# Altium project UNOTH_Rev3.PrjPcb
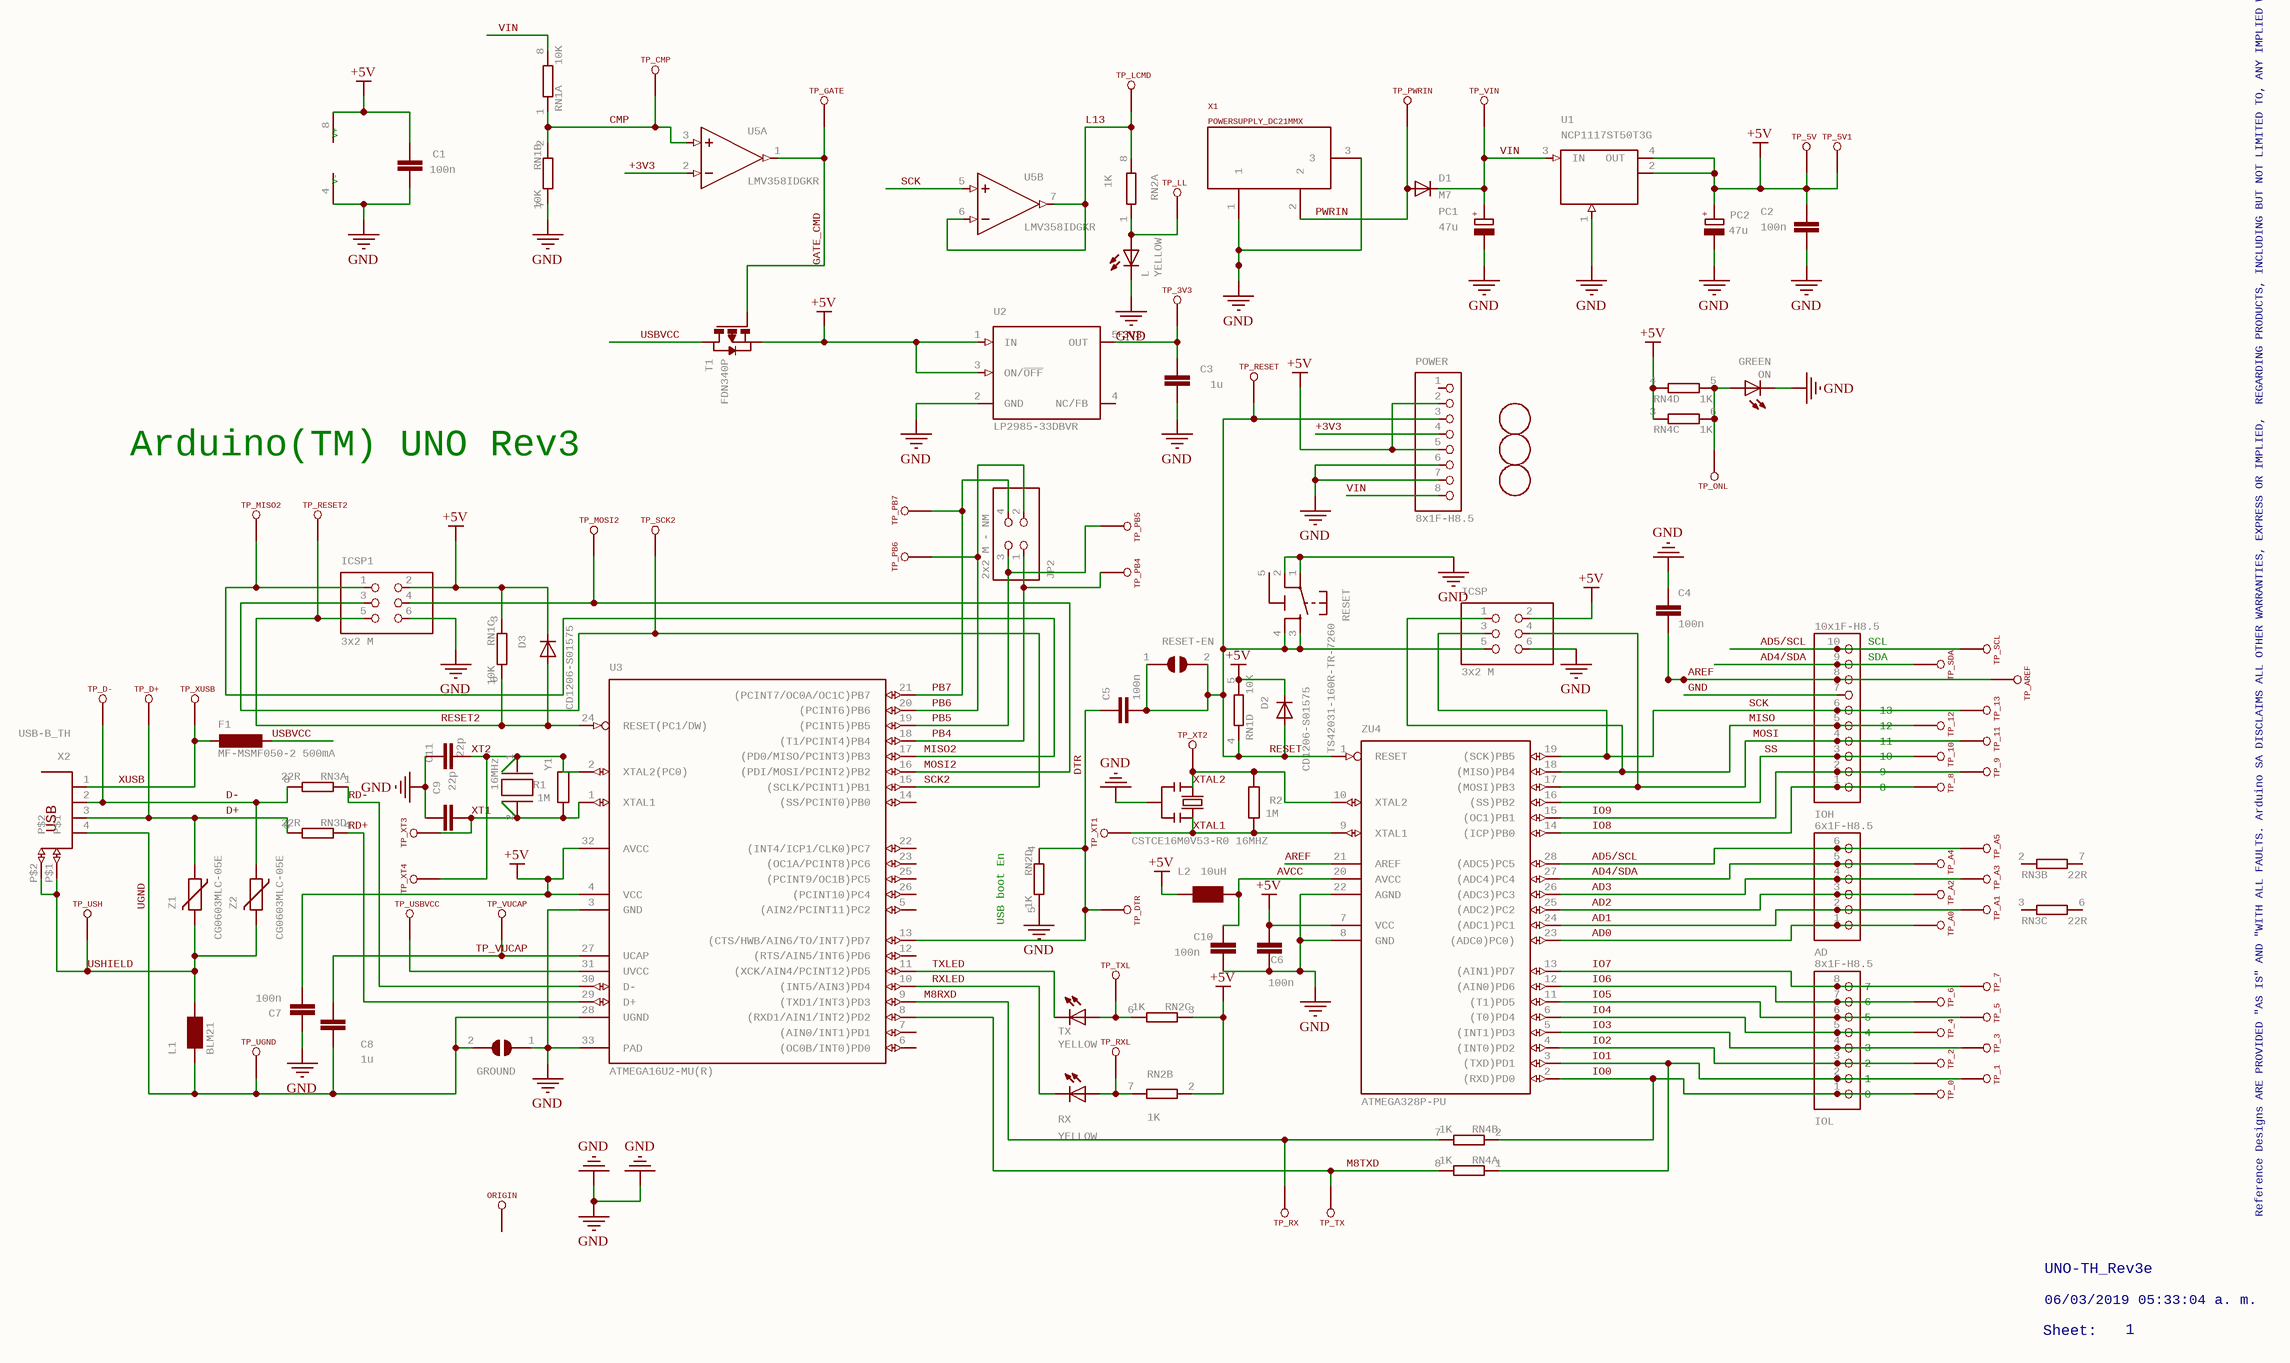
[diagram p0: UNO-TH_Rev3e.SchDoc]
1 sheet, 113 parts. Net scope: global (net labels, ports and power ports of the same name join across sheets).
Board file: UNO-TH_Rev3e.PcbDoc

## Sheet UNO-TH_Rev3e.SchDoc
size 409 x 289 mm; Organization: ORGANIZATION; Address1: ADDRESS 1; Address2: ADDRESS 2; Address3: ADDRESS 3; Address4: ADDRESS 4; Revision: *.*.*; SheetTotal: 1; ENG_APP_DATE: --/--/--; DSN_APP_DATE: --/--/--; CHK_APP_DATE: --/--/--; Origin: Eagle; OriginPath: C:\Users\alima\Downloads\6to_Semestre\DiseñoPCBS\ProyectoFinal\Proyecto-PCB\OficialArduino\UNO-TH_Rev3e-Eagle\UNO-TH_Rev3e.sch; OriginSheet: 1; DRAWING_NAME: UNO-TH_Rev3e; LAST_DATE_TIME: 06/03/2019 05:33:04 a. m.; SHEET: 1; CODE-ARDUINO: DNP; DATASHEET: DNP; DISTRIBUTOR-LINK: DNP; DISTRIBUTOR-PN: DNP; MANUFACTURER: DNP; MANUFACTURER-PN: DNP; NOTE: DNP; Value: DNP; SheetNumber: 1

### Parts
AD  6x1F-H8.5  [1X06]
C1  100n  [C0603-ROUND]
C2  100n  [C0603-ROUND]
C3  1u  [C0603-ROUND]
C4  100n  [C0603-ROUND]
C5  100n  [C0603-ROUND]
C6  100n  [C0603-ROUND]
C7  100n  [C0603-ROUND]
C8  1u  [C0603-ROUND]
C9  22p  [C0603-ROUND]
C10  100n  [C0603-ROUND]
C11  22p  [C0603-ROUND]
D1  M7  [SMB]
D2  CD1206-S01575  [MINIMELF]
D3  CD1206-S01575  [MINIMELF]
F1  MF-MSMF050-2 500mA  [L1812]
FD1  FIDUCIALMOUNT  [FIDUCIA-MOUNT]  (value not drawn)
FD2  FIDUCIALMOUNT  [FIDUCIA-MOUNT]  (value not drawn)
FD3  FIDUCIALMOUNT  [FIDUCIA-MOUNT]  (value not drawn)
GROUND  SJ  [SJ]  (value not drawn)
ICSP  3x2 M  [2X03]
ICSP1  3x2 M  [2X03]
IOH  10x1F-H8.5  [1X10]
IOL  8x1F-H8.5  [1X08]
JP2  2x2 M - NM  [2X02]
L  YELLOW  [CHIP-LED0805]
L1  BLM21  [0805]
L2  10uH  [0805]
ON  GREEN  [CHIP-LED0805]
ORIGIN  TP_SP  [TP-SP]  (value not drawn)
PC1  47u  [PANASONIC_D]
PC2  47u  [PANASONIC_D]
POWER  8x1F-H8.5  [1X08]
R1  1M  [R0603-ROUND]
R2  1M  [R0603-ROUND]
RESET  TS42031-160R-TR-7260  [TS42]
RESET-EN  SJ  [SJ]  (value not drawn)
RN1  10K  [CAY16]  (parts A,B,C,D of 4)
RN2  1K  [CAY16]  (parts A,B,C,D of 4)
RN3  22R  [CAY16]  (parts A,B,C,D of 4)
RN4  1K  [CAY16]  (parts A,B,C,D of 4)
RX  YELLOW  [CHIP-LED0805]
T1  FDN340P  [SOT-23]
TP_0  TP_SP  [TP-SP]  (value not drawn)
TP_1  TP_SP  [TP-SP]  (value not drawn)
TP_2  TP_SP  [TP-SP]  (value not drawn)
TP_3  TP_SP  [TP-SP]  (value not drawn)
TP_3V3  TP_SP  [TP-SP]  (value not drawn)
TP_4  TP_SP  [TP-SP]  (value not drawn)
TP_5  TP_SP  [TP-SP]  (value not drawn)
TP_5V  TP_SP  [TP-SP]  (value not drawn)
TP_5V1  TP_SP  [TP-SP]  (value not drawn)
TP_6  TP_SP  [TP-SP]  (value not drawn)
TP_7  TP_SP  [TP-SP]  (value not drawn)
TP_8  TP_SP  [TP-SP]  (value not drawn)
TP_9  TP_SP  [TP-SP]  (value not drawn)
TP_10  TP_SP  [TP-SP]  (value not drawn)
TP_11  TP_SP  [TP-SP]  (value not drawn)
TP_12  TP_SP  [TP-SP]  (value not drawn)
TP_13  TP_SP  [TP-SP]  (value not drawn)
TP_A0  TP_SP  [TP-SP]  (value not drawn)
TP_A1  TP_SP  [TP-SP]  (value not drawn)
TP_A2  TP_SP  [TP-SP]  (value not drawn)
TP_A3  TP_SP  [TP-SP]  (value not drawn)
TP_A4  TP_SP  [TP-SP]  (value not drawn)
TP_A5  TP_SP  [TP-SP]  (value not drawn)
TP_AREF  TP_SP  [TP-SP]  (value not drawn)
TP_CMP  TP_SP  [TP-SP]  (value not drawn)
TP_D+  TP_SP  [TP-SP]  (value not drawn)
TP_D-  TP_SP  [TP-SP]  (value not drawn)
TP_DTR  TP_SP  [TP-SP]  (value not drawn)
TP_GATE  TP_SP  [TP-SP]  (value not drawn)
TP_LCMD  TP_SP  [TP-SP]  (value not drawn)
TP_LL  TP_SP  [TP-SP]  (value not drawn)
TP_MISO2  TP_SP  [TP-SP]  (value not drawn)
TP_MOSI2  TP_SP  [TP-SP]  (value not drawn)
TP_ONL  TP_SP  [TP-SP]  (value not drawn)
TP_PB4  TP_SP  [TP-SP]  (value not drawn)
TP_PB5  TP_SP  [TP-SP]  (value not drawn)
TP_PB6  TP_SP  [TP-SP]  (value not drawn)
TP_PB7  TP_SP  [TP-SP]  (value not drawn)
TP_PWRIN  TP_SP  [TP-SP]  (value not drawn)
TP_RESET  TP_SP  [TP-SP]  (value not drawn)
TP_RESET2  TP_SP  [TP-SP]  (value not drawn)
TP_RX  TP_SP  [TP-SP]  (value not drawn)
TP_RXL  TP_SP  [TP-SP]  (value not drawn)
TP_SCK2  TP_SP  [TP-SP]  (value not drawn)
TP_SCL  TP_SP  [TP-SP]  (value not drawn)
TP_SDA  TP_SP  [TP-SP]  (value not drawn)
TP_TX  TP_SP  [TP-SP]  (value not drawn)
TP_TXL  TP_SP  [TP-SP]  (value not drawn)
TP_UGND  TP_SP  [TP-SP]  (value not drawn)
TP_USBVCC  TP_SP  [TP-SP]  (value not drawn)
TP_USH  TP_SP  [TP-SP]  (value not drawn)
TP_VIN  TP_SP  [TP-SP]  (value not drawn)
TP_VUCAP  TP_SP  [TP-SP]  (value not drawn)
TP_XT1  TP_SP  [TP-SP]  (value not drawn)
TP_XT2  TP_SP  [TP-SP]  (value not drawn)
TP_XT3  TP_SP  [TP-SP]  (value not drawn)
TP_XT4  TP_SP  [TP-SP]  (value not drawn)
TP_XUSB  TP_SP  [TP-SP]  (value not drawn)
TX  YELLOW  [CHIP-LED0805]
U1  NCP1117ST50T3G  [SOT223]
U2  LP2985-33DBVR  [SOT23-DBV]
U3  ATMEGA16U2-MU(R)  [MLF32]
U5  LMV358IDGKR  [MSOP08]  (parts A,B,C of 3)
X1  POWERSUPPLY_DC21MMX  [POWERSUPPLY_DC-21MM]
X2  USB-B_TH  [PN61729]
Y1  16MHz  [QS]
Y2  CSTCE16M0V53-R0 16MHZ  [RESONATOR]
Z1  CG0603MLC-05E  [CT/CN0603]
Z2  CG0603MLC-05E  [CT/CN0603]
ZU4  ATMEGA328P-PU  [DIL28-3]

### Nets
+5V: C1.2 C2.2 C6.2 C7.1 D2.C D3.C ICSP.2 ICSP1.2 L2.1 PC2.+ POWER.2 POWER.5 RN1.3 RN1.5 RN2.2 RN2.3 RN4.3 RN4.4 T1.2(S) TP_5V.X(TESTP) TP_5V1.X(TESTP) U1.2(OUT) U1.4(OUT) U2.1(IN) U2.3(ON/~{OFF}) U3.4(VCC) U3.32(AVCC) U5.8(V+) ZU4.7(VCC)
GND: C1.1 C2.1 C3.1 C4.1 C6.1 C7.2 C9.2 C10.1 C11.2 GROUND.1 ICSP.6 ICSP1.6 IOH.7 L.C ON.C PC1.- PC2.- POWER.6 POWER.7 RESET.1 RESET.2 RN1.7 RN2.5 U1.1(GND/ADJ) U2.2(GND) U3.3(GND) U3.33(PAD) U5.4(V-) X1.1 X1.3 Y2.2 ZU4.8(GND) ZU4.22(AGND)
+3V3: C3.2 POWER.4 TP_3V3.X(TESTP) U2.5(OUT) U5.2(-IN)
AD0: AD.1 TP_A0.X(TESTP) ZU4.23((ADC0)PC0))
AD1: AD.2 TP_A1.X(TESTP) ZU4.24((ADC1)PC1)
AD2: AD.3 TP_A2.X(TESTP) ZU4.25((ADC2)PC2)
AD3: AD.4 TP_A3.X(TESTP) ZU4.26((ADC3)PC3)
AD4/SDA: AD.5 IOH.9 TP_A4.X(TESTP) TP_SDA.X(TESTP) ZU4.27((ADC4)PC4)
AD5/SCL: AD.6 IOH.10 TP_A5.X(TESTP) TP_SCL.X(TESTP) ZU4.28((ADC5)PC5)
AREF: C4.2 IOH.8 TP_AREF.X(TESTP) ZU4.21(AREF)
AVCC: C10.2 L2.2 ZU4.20(AVCC)
CMP: RN1.1 RN1.2 TP_CMP.X(TESTP) U5.3(+IN)
D+: RN3.5 TP_D+.X(TESTP) X2.3 Z1.1
D-: RN3.8 TP_D-.X(TESTP) X2.2 Z2.1
DTR: C5.1 RN2.4 TP_DTR.X(TESTP) U3.13((CTS/HWB/AIN6/TO/INT7)PD7)
GATE_CMD: T1.3(G) TP_GATE.X(TESTP) U5.1(OUT)
IO0: IOL.1 RN4.2 TP_0.X(TESTP) ZU4.2((RXD)PD0)
IO1: IOL.2 RN4.1 TP_1.X(TESTP) ZU4.3((TXD)PD1)
IO2: IOL.3 TP_2.X(TESTP) ZU4.4((INT0)PD2)
IO3: IOL.4 TP_3.X(TESTP) ZU4.5((INT1)PD3)
IO4: IOL.5 TP_4.X(TESTP) ZU4.6((T0)PD4)
IO5: IOL.6 TP_5.X(TESTP) ZU4.11((T1)PD5)
IO6: IOL.7 TP_6.X(TESTP) ZU4.12((AIN0)PD6)
IO7: IOL.8 TP_7.X(TESTP) ZU4.13((AIN1)PD7)
IO8: IOH.1 TP_8.X(TESTP) ZU4.14((ICP)PB0)
IO9: IOH.2 TP_9.X(TESTP) ZU4.15((OC1)PB1)
L13: RN2.8 TP_LCMD.X(TESTP) U5.6(-IN) U5.7(OUT)
M8RXD: RN4.7 TP_RX.X(TESTP) U3.9((TXD1/INT3)PD3)
M8TXD: RN4.8 TP_TX.X(TESTP) U3.8((RXD1/AIN1/INT2)PD2)
MISO: ICSP.1 IOH.5 TP_12.X(TESTP) ZU4.18((MISO)PB4)
MISO2: ICSP1.1 TP_MISO2.X(TESTP) U3.17((PD0/MISO/PCINT3)PB3)
MOSI: ICSP.4 IOH.4 TP_11.X(TESTP) ZU4.17((MOSI)PB3)
MOSI2: ICSP1.4 TP_MOSI2.X(TESTP) U3.16((PDI/MOSI/PCINT2)PB2)
PB4: JP2.1 TP_PB4.X(TESTP) U3.18((T1/PCINT4)PB4)
PB5: JP2.3 TP_PB5.X(TESTP) U3.19((PCINT5)PB5)
PB6: JP2.2 TP_PB6.X(TESTP) U3.20((PCINT6)PB6)
PB7: JP2.4 TP_PB7.X(TESTP) U3.21((PCINT7/OC0A/OC1C)PB7)
PWRIN: D1.A TP_PWRIN.X(TESTP) X1.2
RD+: RN3.4 U3.29(D+)
RD-: RN3.1 U3.30(D-)
RESET: C5.2 D2.A ICSP.5 POWER.3 RESET.3 RESET.4 RESET-EN.1 RESET-EN.2 RN1.4 TP_RESET.X(TESTP) ZU4.1(RESET)
RESET2: D3.A ICSP1.5 RN1.6 TP_RESET2.X(TESTP) U3.24(RESET(PC1/DW))
RXLED: RX.C U3.10((INT5/AIN3)PD4)
SCK: ICSP.3 IOH.6 TP_13.X(TESTP) U5.5(+IN) ZU4.19((SCK)PB5)
SCK2: ICSP1.3 TP_SCK2.X(TESTP) U3.15((SCLK/PCINT1)PB1)
SS: IOH.3 TP_10.X(TESTP) ZU4.16((SS)PB2)
TP_VUCAP: C8.1 TP_VUCAP.X(TESTP) U3.27(UCAP)
TXLED: TX.C U3.11((XCK/AIN4/PCINT12)PD5)
UGND: C8.2 GROUND.2 L1.1 TP_UGND.X(TESTP) U3.28(UGND) X2.4
USBVCC: F1.1 T1.1(D)
USHIELD: L1.2 TP_USH.X(TESTP) X2.P$1 X2.P$2 Z1.2 Z2.2
VIN: D1.C PC1.+ POWER.8 RN1.8 TP_VIN.X(TESTP) U1.3(IN)
XT1: C9.1 R1.1 TP_XT3.X(TESTP) U3.1(XTAL1) Y1.2
XT2: C11.1 R1.2 TP_XT4.X(TESTP) U3.2(XTAL2(PC0)) Y1.1
XTAL1: R2.1 TP_XT1.X(TESTP) Y2.3 ZU4.9(XTAL1)
XTAL2: R2.2 TP_XT2.X(TESTP) Y2.1 ZU4.10(XTAL2)
XUSB: F1.2 TP_XUSB.X(TESTP) X2.1
NetL_A: L.A RN2.1 TP_LL.X(TESTP)
NetON_A: ON.A RN4.5 RN4.6 TP_ONL.X(TESTP)
NetRN2_6: RN2.6 TP_TXL.X(TESTP) TX.A
NetRN2_7: RN2.7 RX.A TP_RXL.X(TESTP)
NetTP_USBVCC_X: TP_USBVCC.X(TESTP) U3.31(UVCC)

Not connected (* = marked no-connect by the designer): ORIGIN X(TESTP); POWER 1; RESET 5(5-GND); RN3 2(1) 3(1) 6(2) 7(2); U2 4(NC/FB); U3 5((AIN2/PCINT11)PC2) 6((OC0B/INT0)PD0) 7((AIN0/INT1)PD1) 12((RTS/AIN5/INT6)PD6) 14((SS/PCINT0)PB0) 22((INT4/ICP1/CLK0)PC7) 23((OC1A/PCINT8)PC6) 25((PCINT9/OC1B)PC5) 26((PCINT10)PC4)

### Notes on the sheet
- Arduino(TM) UNO Rev3
- (near IOH) SDA
- (near IOH) SCL
- (near IOH) 11
- (near IOH) 12
- (near IOH) 13
- (near IOH) 8
- (near IOH) 9
- (near IOH) 10
- (near RN2) USB boot En
- (near IOL) 3
- (near IOL) 4
- (near IOL) 5
- (near IOL) 6
- (near IOL) 7
- (near IOL) 0
- (near IOL) 1
- (near IOL) 2
- Reference Designs ARE PROVIDED "AS IS" AND "WITH ALL FAULTS. Arduino SA DISCLAIMS ALL OTHER WARRANTIES, EXPRESS OR IMPLIED,
  REGARDING PRODUCTS, INCLUDING BUT NOT LIMITED TO, ANY IMPLIED WARRANTIES OF MERCHANTABILITY OR FITNESS FOR A PARTICULAR PURPOSE
  Arduino SA may make changes to specifications and product descriptions at any time, without notice. The Customer must not
  rely on the absence or characteristics of any features or instructions marked "reserved" or "undefined." Arduino SA reserves
  these for future definition and shall have no responsibility whatsoever for conflicts or incompatibilities arising from future changes to them.
  The product information on the Web Site or Materials is subject to change without notice. Do not finalize a design with this info
  ARDUINO and other Arduino brands and logos and Trademarks of Arduino SA. All Arduino SA Trademarks cannot be used without owner's formal permission
- UNO-TH_Rev3e
- Sheet:
- 06/03/2019 05:33:04 a. m.
- 1
- TITLE
- DESIGNER
- PRODUCT NUMBER
- SHEET VERSION
- LAST MODIFIED
- SHEET
- OF

### Library data of the parts
AD = PINHD-1X6: PIN HEADER; GateName_1: A; SymbolName_1: PINHD6; LibraryName: SmartPrj; DeviceSetName: PINHD-1X6
C1-C11 = C-EU0603-RND: CAPACITOR, European symbol; GateName_1: G$1; SymbolName_1: C-EU; DeviceName: 0603-RND; LibraryName: SmartPrj; DeviceSetName: C-EU
D1 = DIODE-SMB: DIODE; GateName_1: G$1; SymbolName_1: D; DeviceSetName: DIODE-; DeviceName: SMB; LibraryName: diode
D2 D3 = DIODE-MINIMELF: DIODE; GateName_1: G$1; SymbolName_1: D; DeviceSetName: DIODE-; DeviceName: MINIMELF; LibraryName: diode
F1 = L-EUL1812: INDUCTOR, European symbol; GateName_1: G$1; SymbolName_1: L-EU; DeviceName: L1812; LibraryName: rcl; DeviceSetName: L-EU
FD1-FD3 = FIDUCIALMOUNT: GateName_1: G$1; SymbolName_1: FIDUCIAL; LibraryName: SmartPrj; DeviceSetName: FIDUCIALMOUNT
GROUND RESET-EN = SJ: SMD solder JUMPER; GateName_1: 1; SymbolName_1: SJ; LibraryName: jumper; DeviceSetName: SJ
ICSP ICSP1 = PINHD-2X3: PIN HEADER; GateName_1: A; SymbolName_1: PINH2X3; LibraryName: SmartPrj; DeviceSetName: PINHD-2X3
IOH = PINHD-1X10_ARD: PIN HEADER; GateName_1: A; SymbolName_1: PINHD10; LibraryName: SmartPrj; DeviceSetName: PINHD-1X10_ARD
IOL POWER = PINHD-1X8: PIN HEADER; GateName_1: A; SymbolName_1: PINHD8; LibraryName: SmartPrj; DeviceSetName: PINHD-1X8
JP2 = PINHD-2X2: PIN HEADER; GateName_1: A; SymbolName_1: PINH2X2; LibraryName: SmartPrj; DeviceSetName: PINHD-2X2
L ON RX TX = LEDCHIP-LED0805: LED   OSRAM: - CHIPLED LG R971, LG N971, LY N971, LG Q971, LY Q971, LO R971, LY R971 LH N974, LH R974 LS Q976, LO Q976, LY Q976 LO Q996 - Hyper CHIPLED LW Q18S LB Q993, LB Q99A, LB R99A - SideLED LS A670, LO A670, LY A670, LG A670, LP A670 LB A673, LV A673, LT A673, LW A673 LH A674 LY A675 LS A676, LA A676, LO A676, LY A676, LW A676 LS A679, LY A679, LG A679 -  Hyper Micro SIDELEDÂ® LS Y876, LA Y876, LO Y876, LY Y876 LT Y87S - SmartLED LW L88C, LW L88S LB L89C, LB L89S, LG L890 LS L89K, LO L89K, LY L89K LS L896, LA L896, LO L896, LY L896 - TOPLED LS T670, LO T670, LY T670, LG T670, LP T670 LSG T670, LSP T670, LSY T670, LOP T670, LYG T670 LG T671, LOG T671, LSG T671 LB T673, LV T673, LT T673, LW T673 LH T674 LS T676, LA T676, LO T676, LY T676, LB T676, LH T676, LSB T676, LW T676 LB T67C, LV T67C, LT T67C, LS T67K, LO T67K, LY T67K, LW E67C LS E67B, LA E67B, LO E67B, LY E67B, LB E67C, LV E67C, LT E67C LW T67C LS T679, LY T679, LG T679 LS T770, LO T770, LY T770, LG T770, LP T770 LB T773, LV T773, LT T773, LW T773 LH T774 LS E675, LA E675, LY E675, LS T675 LS T776, LA T776, LO T776, LY T776, LB T776 LHGB T686 LT T68C, LB T68C - Hyper Mini TOPLEDÂ® LB M676 - Mini TOPLED SantanaÂ® LG M470 LS M47K, LO M47K, LY M47K    Source: http://www.osram.convergy.de   LUXEON: - LUMILEDÂ® LXK2-PW12-R00, LXK2-PW12-S00, LXK2-PW14-U00, LXK2-PW14-V00 LXK2-PM12-R00, LXK2-PM12-S00, LXK2-PM14-U00 LXK2-PE12-Q00, LXK2-PE12-R00, LXK2-PE12-S00, LXK2-PE14-T00, LXK2-PE14-U00 LXK2-PB12-K00, LXK2-PB12-L00, LXK2-PB12-M00, LXK2-PB14-N00, LXK2-PB14-P00, LXK2-PB14-Q00 LXK2-PR12-L00, LXK2-PR12-M00, LXK2-PR14-Q00, LXK2-PR14-R00 LXK2-PD12-Q00, LXK2-PD12-R00, LXK2-PD12-S00 LXK2-PH12-R00, LXK2-PH12-S00 LXK2-PL12-P00, LXK2-PL12-Q00, LXK2-PL12-R00    Source: www.luxeon.com   KINGBRIGHT:   KA-3528ASYC Source: www.kingbright.com; GateName_1: G$1; SymbolName_1: LED; DeviceName: CHIP-LED0805; LibraryName: led; DeviceSetName: LED
L1 = WE-CBF_0805: SMD EMI Suppression Ferrite Beads - excellent anti-EMI properties - low DCR - impedances till 3000 ohms - rated current up to 6 A; GateName_1: G$1; SymbolName_1: L; DeviceName: _0805; DeviceSetName: WE-CBF; LibraryName: wuerth-elektronik
L2 = 0715_CV201210-100K: 10uH 0805; GateName_1: G$1; SymbolName_1: L; MONTHLY_USAGE: _____; TYPE: Induttanze; LibraryName: Induttanze; DeviceSetName: 0715_CV201210-100K; CASE: 0805; PART_NUMBER: CV201210-100K; PRICE: _____; SUPPLIER: _____
ORIGIN TP_0-TP_3 TP_3V3 TP_4 TP_5 TP_5V TP_5V1 TP_6-TP_13 TP_A0-TP_A5 TP_AREF TP_CMP TP_D+ TP_D- TP_DTR TP_GATE TP_LCMD TP_LL TP_MISO2 TP_MOSI2 TP_ONL TP_PB4-TP_PB7 TP_PWRIN TP_RESET TP_RESET2 TP_RX TP_RXL TP_SCK2 TP_SCL TP_SDA TP_TX TP_TXL TP_UGND TP_USBVCC TP_USH TP_VIN TP_VUCAP TP_XT1-TP_XT4 TP_XUSB = TP_SP: GateName_1: G$1; SymbolName_1: TP-SP; LibraryName: SmartPrj; DeviceSetName: TP_SP
PC1 PC2 = CPOL-EUD: POLARIZED CAPACITOR, European symbol; GateName_1: G$1; SymbolName_1: CPOL; DeviceName: D; LibraryName: rcl; DeviceSetName: CPOL-EU; +: +
R1 R2 = R-EU_R0603: RESISTOR, European symbol; GateName_1: G$1; SymbolName_1: R-EU; DeviceName: R0603; DeviceSetName: R-EU_; LibraryName: SmartPrj
RESET = TS42: TS42 Dongnan Electronics Tact switch VDC 12V - 50mA; GateName_1: G$1; SymbolName_1: ST-MOD_V1.4_TS42; LibraryName: SmartPrj; DeviceSetName: TS42
RN1-RN4 = 4R-NCAY16: Array Chip Resistor   Source: RS Component / Phycomp; GateName_1: A; SymbolName_1: R1NV; GateName_2: B; GateName_3: C; GateName_4: D; DeviceSetName: 4R-N; SymbolName_2: R1NV; SymbolName_3: R1NV; SymbolName_4: R1NV; DeviceName: CAY16; LibraryName: resistor-dil
T1 = PMOSSOT23: MOS FET; GateName_1: A; SymbolName_1: P_MOSFET; LibraryName: zetex; DeviceSetName: PMOSSOT23
U1 = MC33269ST*: Adjustable Output Low Dropout Voltage Regulator 800 mA   Source: http://www.onsemi.com/pub/Collateral/MC33269-D.PDF; GateName_1: G$1; SymbolName_1: VREG-O2; LibraryName: linear; DeviceSetName: MC33269ST*
U2 = LP2985-XXDBVR: ULTRALOW-POWER 50-mA LOW-DROPOUT LINEAR REGULATORS   50-mA Low-Dropout Regulator Source: http://focus.ti.com/lit/ds/symlink/tps77001.pdf; GateName_1: G$1; SymbolName_1: LP2985-XXDBVR; LibraryName: SmartPrj; DeviceSetName: LP2985-XXDBVR
U3 = ATMEGA16U2-MU: GateName_1: G$1; SymbolName_1: ATMEL_MEGA8U2; DeviceName: MU; LibraryName: SmartPrj; DeviceSetName: ATMEGA16U2-
U5 = LMV358?*MM: Dual General Purpose, Low Voltage, Rail-to-Rail Output Operational Amplifiers   Source: http://www.national.com/mpf/LM/LMV321.html http://www.national.com/dt/lmv_qual.pdf; GateName_1: A; SymbolName_1: OPAMP; GateName_2: B; GateName_3: P; SymbolName_3: PWR+-; DeviceName: MM; SymbolName_2: OPAMP; LibraryName: linear; DeviceSetName: LMV358?*
X1 = POWERSUPPLY_DC21MMX: GateName_1: G$1; SymbolName_1: POWERSUPPLY_DC21PWR; DeviceName: X; LibraryName: SmartPrj; DeviceSetName: POWERSUPPLY_DC21MM
X2 = PN61729: BERG USB connector; GateName_1: G$1; SymbolName_1: J11; LibraryName: SmartPrj; DeviceSetName: PN61729; USB: USB
Y1 = XTAL/S: CRYSTAL; GateName_1: G$1; SymbolName_1: XTAL; LibraryName: SmartPrj; DeviceSetName: XTAL/S
Y2 = RESONATORMU: GateName_1: G$1; DeviceName: MU; SymbolName_1: RESONATOR; LibraryName: SmartPrj; DeviceSetName: RESONATOR
Z1 Z2 = VARISTORCN0603: VARISTOR; GateName_1: G$1; DeviceName: CN0603; SymbolName_1: VARISTOR; LibraryName: varistor; DeviceSetName: VARISTOR
ZU4 = ATMEGA328P-PU: MICROCONTROLLER   4 Kbytes FLASH   128 bytes SRAM   256 bytes EEPROM   UART   6-channel 10 bit ADC; GateName_1: G$1; SymbolName_1: 20-I/O-2; DeviceName: PU; LibraryName: SmartPrj; DeviceSetName: ATMEGA328P-